# EAGLE schematic Adafruit MicroUSB Lipo (EAGLE 9.1.1)
AUTHOR: K. TOWNSEND
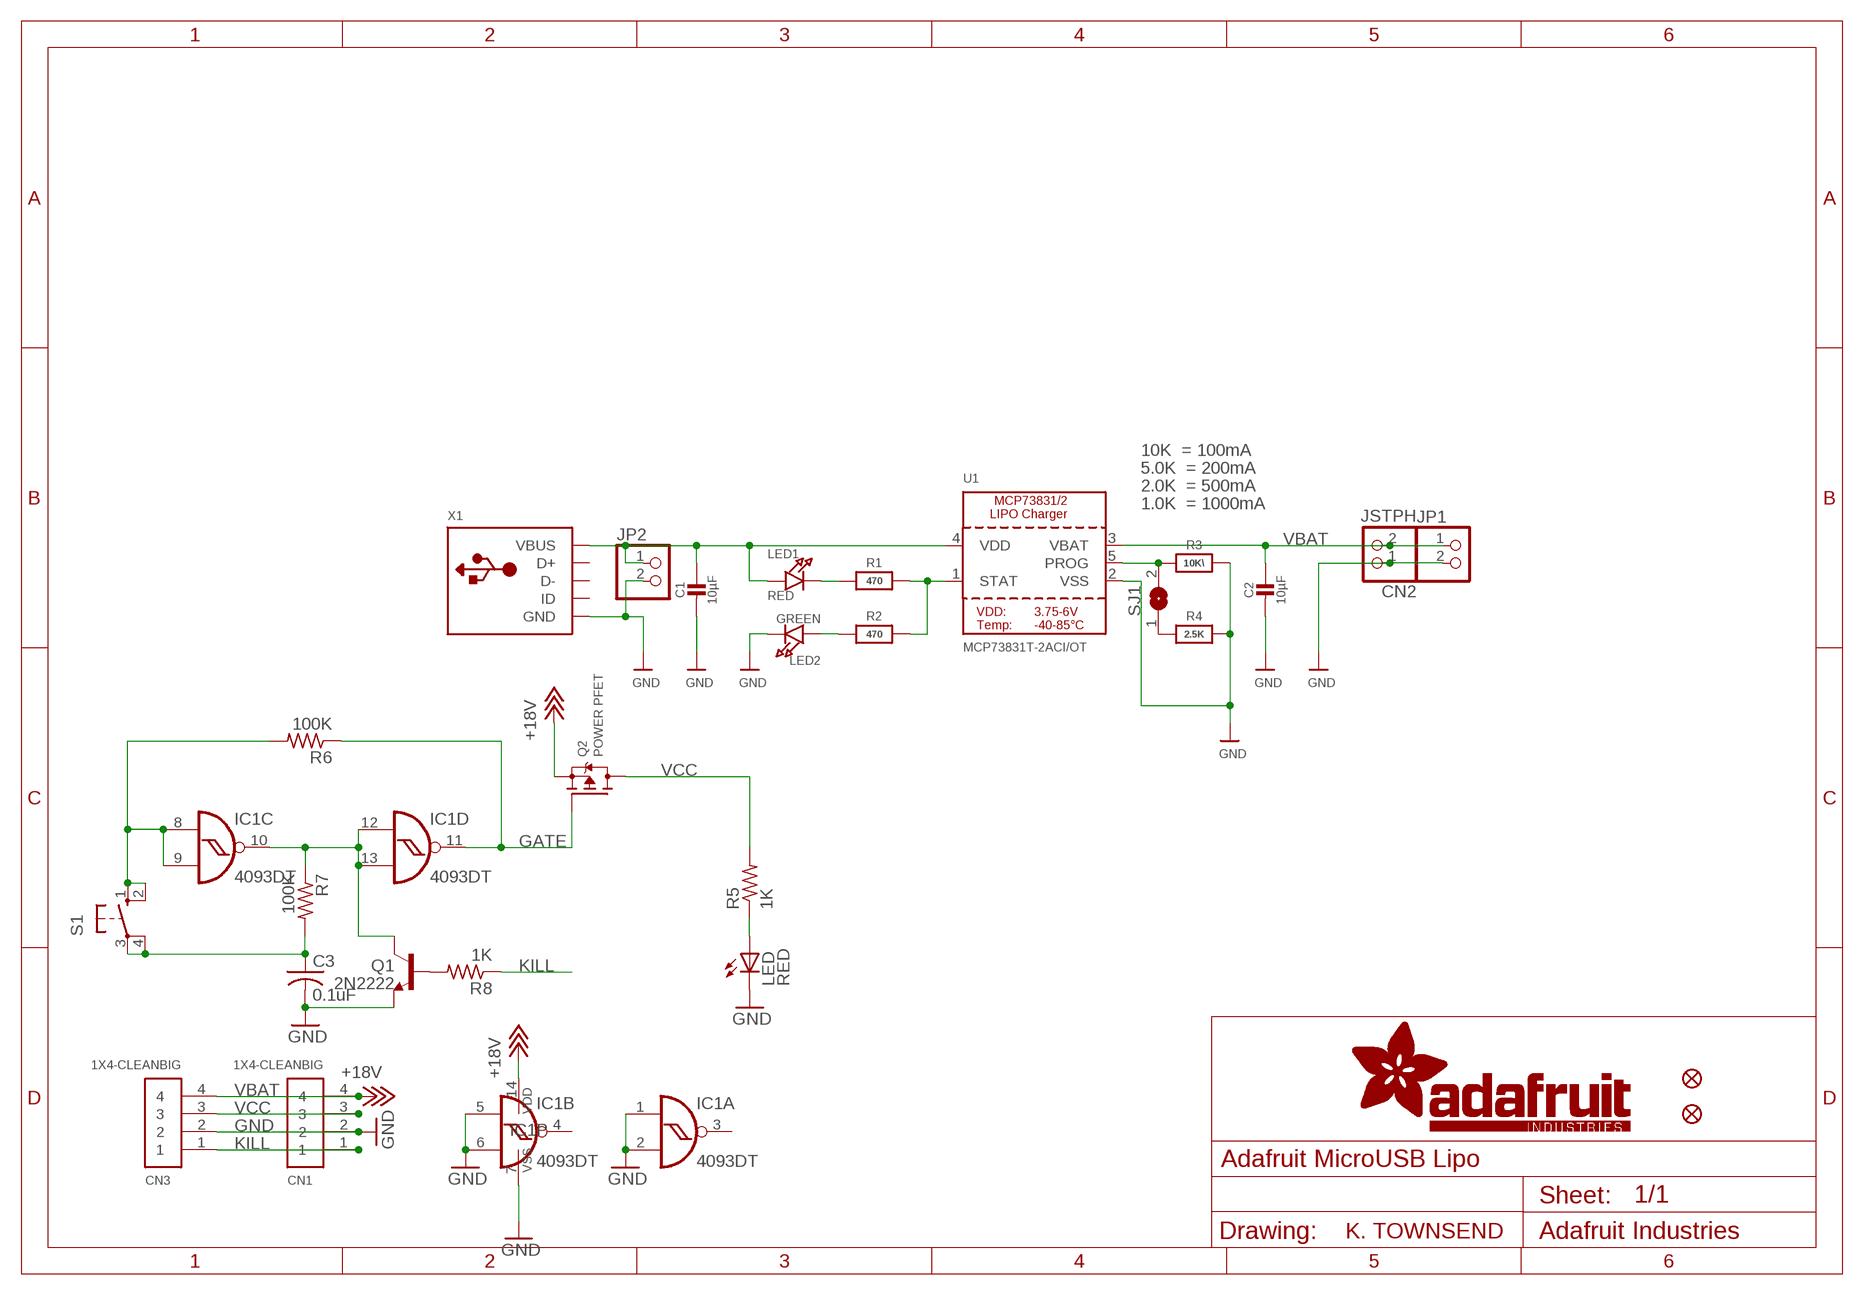
[diagram p0: schematic, sheet 1]

## Parts
C1  10µF  CAP_CERAMIC0805-NOOUTLINE  [0805-NO]
C2  10µF  CAP_CERAMIC0805-NOOUTLINE  [0805-NO]
C3  0.1uF  C-USC0805  [C0805]
CN1  1X4-CLEANBIG  [1X04-CLEANBIG]
CN2  JSTPH  JST_2PIN  [JSTPH2]
CN3  1X4-CLEANBIG  [1X04-CLEANBIG]
FID1  FIDUCIAL""  [FIDUCIAL_1MM]
FID2  FIDUCIAL""  [FIDUCIAL_1MM]
IC1  4093DT  [MC14093B-TSSOP14]
JP1  HEADER-1X2ROUND  [1X02_ROUND]
JP2  HEADER-1X2ROUND  [1X02_ROUND]
LED  RED  LEDCHIP-LED0805  [CHIP-LED0805]
LED1  RED  LED0805_NOOUTLINE  [CHIPLED_0805_NOOUTLINE]
LED2  GREEN  LED0805_NOOUTLINE  [CHIPLED_0805_NOOUTLINE]
Q1  2N2222  MMBT2222ALT1-NPN-SOT23-BEC  [SOT23-BEC]
Q2  POWER PFET  MOSFET-PWIDE  [SOT23-WIDE]
R1  470  RESISTOR0805_NOOUTLINE  [0805-NO]
R2  470  RESISTOR0805_NOOUTLINE  [0805-NO]
R3  10K\  RESISTOR0805_NOOUTLINE  [0805-NO]
R4  2.5K  RESISTOR0805_NOOUTLINE  [0805-NO]
R5  1K  R-US_R0805  [R0805]
R6  100K  R-US_R0805  [R0805]
R7  100K  R-US_R0805  [R0805]
R8  1K  R-US_R0805  [R0805]
S1  40-XX-ROUND  [B3F-40XX-ROUND]
SJ1  SOLDERJUMPER  [SOLDERJUMPER_ARROW_NOPASTE]
U1  MCP73831T-2ACI/OT  MCP73831/2  [SOT23-5]
X1  USBMICRO_20329  [4UCONN_20329]

## Nets
GATE: IC1.11(D:O) Q2.1(G) R6.1
GND: C1.2 C2.2 C3.2 CN1.2 CN2.1 CN3.2 IC1.1(A:I0) IC1.2(A:I1) IC1.5(B:I0) IC1.6(B:I1) IC1.7(P:VSS) JP1.2 JP2.2 LED2.C LED.C Q1.E R3.2 R4.2 U1.2(VSS) X1.BASE@1(GND) X1.BASE@2(GND) X1.GND X1.SPRT@1(GND) X1.SPRT@2(GND) X1.SPRT@3(GND) X1.SPRT@4(GND)
KILL: CN1.1 CN3.1 R8.1
N$1: LED1.C R1.1
N$2: R1.2 R2.2 U1.1(STAT)
N$3: R4.1 SJ1.1
N$4: IC1.10(C:O) IC1.12(D:I0) IC1.13(D:I1) Q1.C R7.1
N$5: R3.1 SJ1.2 U1.5(PROG)
N$6: LED2.A R2.1
N$7: LED.A R5.1
N$8: C3.1 R7.2 S1.3(P) S1.4(P1)
N$9: IC1.8(C:I0) IC1.9(C:I1) R6.2 S1.1(S) S1.2(S1)
N$10: Q1.B R8.2
VBAT: C2.1 CN1.4 CN2.2 CN3.4 IC1.14(P:VDD) JP1.1 Q2.2(S) U1.3(VBAT) ; supply symbol labelled +18V
VCC: CN1.3 CN3.3 Q2.3(D) R5.2
VDD: C1.1 JP2.1 LED1.A U1.4(VDD) X1.VBUS
Unconnected: IC1.3(A:O) IC1.4(B:O) X1.D+ X1.D- X1.ID

## Notes on the sheet
- 10K  = 100mA
- 5.0K  = 200mA
- 2.0K  = 500mA
- 1.0K  = 1000mA

## Library data of the parts
C1 C2 = microbuilder:CAP_CERAMIC: Ceramic Capacitors For new designs, use the packages preceded by an '_' character since they are more reliable: The following footprints should be used on most boards: _0402 - Standard footprint for regular board layouts _0603 - Standard footprint for regular board layouts _0805 - Standard footprint for regular board layouts _1206 - Standard footprint for regular board layouts For extremely tight-pitch boards where space is at a premium, the following 'micro-pitch' footprints can be used (smaller pads, no silkscreen outline, etc.): _0402MP - Micro-pitch footprint for very dense/compact boards _0603MP - Micro-pitch footprint for very dense/compact boards _0805MP - Micro-pitch footprint for very dense/compact boards _1206MP - Micro-pitch footprint for very dense/compact boards
C3 = adafruit:C-US: CAPACITOR, American symbol
CN1 CN3 = adafruit:1X4: 4-pin connector
CN2 = microbuilder:JST_2PIN: JST 2-Pin Right-Angle Connector PH-Series - 4UConnector: 17311 SH-Series - 4UConnector: 07278
FID1 FID2 = microbuilder:FIDUCIAL: Fiducial Alignment Points Various fiducial points for machine vision alignment.; BOM: EXCLUDE
IC1 = adafruit:4093: Quad 2-input NAND schmitt trigger
JP1 JP2 = microbuilder:HEADER-1X2: PIN HEADER
LED = adafruit:LED: LED
LED1 LED2 = microbuilder:LED: LED
Q1 = transistor:*-NPN-: NPN Transistror BF959 corrected 2008.03.06
Q2 = microbuilder:MOSFET-P: P-Channel Mosfet LEGEND VDS: Voltage Drain-Source ID: Drain Current RDS(ON): Drain-Source On-State Resistance VGS(TH): Gate-Source Threshold Voltage CISS: Drain-Source Input Capacitance SOT-23 Name VDS ID RDS(ON) VGS(TH) CISS Order Number IRLML5103 30V 760mA 600 mOhm -- 75pF @ 25V Digikey: IRLML5103PBFCT-ND IRLML6401 12V 4.3A 50 mOhm 950mV @ 250µA 830pF @ 10V Digikey: IRLML6401PBFTR-ND NTR0202PL 20V 400mA 800 mOhm 2.3V @ 250uA 70pF @ 5V Digikey: NTR0202PLT1GOSTR-ND NTR4101PT1G 20V 1.8A 85 mOhm 1.2V @ 250uA 675pF @ 10V Digikey: NTR4101PT1GOSCT-ND DMP2004K 20V 600mA 900 mOhm 1V @ 250uA 175pF @ 16V Digikey: DMP2004KDICT-ND PMV65XP 20V 3.9A 76 mOhm 950mV @ 1mA 725pF @ 20V Digikey: 568-2358-2-ND TO-252 Name VDS ID RDS(ON) VGS(TH) CISS Order Number AOD417 30V 25A 34 mOhm 3V @ 250µA 920pF @ 15V Digikey: 785-1106-2-ND
R1-R4 = microbuilder:RESISTOR: Resistors For new designs, use the packages preceded by an '_' character since they are more reliable: The following footprints should be used on most boards: _0402 - Standard footprint for regular board layouts _0603 - Standard footprint for regular board layouts _0805 - Standard footprint for regular board layouts _1206 - Standard footprint for regular board layouts For extremely tight-pitch boards where space is at a premium, the following 'micro-pitch' footprints can be used (smaller pads, no silkscreen outline, etc.): _0402MP - Micro-pitch footprint for very dense/compact boards _0603MP - Micro-pitch footprint for very dense/compact boards _0805MP - Micro-pitch footprint for very dense/compact boards _1206MP - Micro-pitch footprint for very dense/compact boards
R5-R7 = rcl:R-US_: RESISTOR, American symbol
R8 = adafruit:R-US_: RESISTOR, American symbol
S1 = adafruit:40-XX: OMRON SWITCH
SJ1 = microbuilder:SOLDERJUMPER: SMD Solder JUMPER Solder the two pads together to create a connection, or remove the solder to break it. REFLOW - Use this footprint for solder paste and reflow ovens. WAVE - Use this footprint for hand-soldering (larger pads). CLOSED - Has a trace between the two pads to ensure it is closed by default. The trace needs to be cut to disable the jumper, and can be closed again by creating a solder bridge between the two pads.; BOM: EXCLUDE
U1 = microbuilder:MCP73831/2: MCP73831/2 LIPO Charger VDD: 3.75 - 6V Temp -40 - 85°C Programmable Charge Rate: 15-500mA NOTE: STAT is a tri-state logic output on the MCP73831 and an open-drain output on the MCP73832. SOT23-5 with 4.2V output and tri-state logic on STAT = MCP73831T-2ACI/OT
X1 = microbuilder:USB: USB Connectors USBMINIB - Surface Mount Female Mini-B USB Connector 4UConnector: 06564